# Altium project PowerPCB.PrjPcb
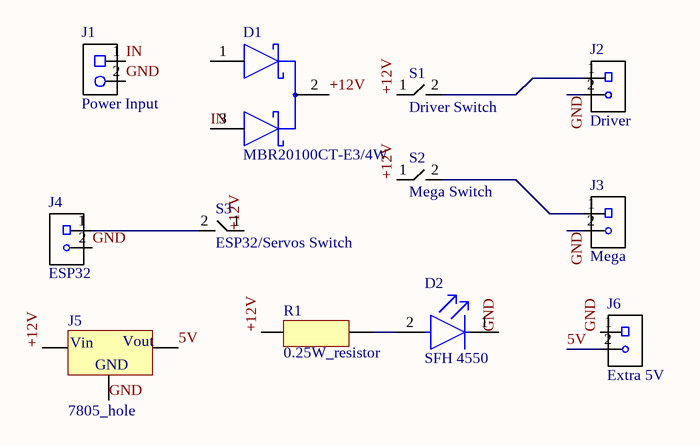
[diagram p0: PowerSCH.SchDoc]
1 sheet, 12 parts. Net scope: global (net labels, ports and power ports of the same name join across sheets).
Board file: PowerPCB.PcbDoc

## Sheet PowerSCH.SchDoc
size A; SheetNumber: 1; SheetTotal: 1

### Parts
D1  MBR20100CT-E3/4W  [FP-MBR20100CT-E3-4W-MFG]
D2  SFH 4550  [FP-SFH_4550-MFG]
J1  Power Input  [Barrier Terminal 2P]
J2  Driver  [Screw Terminal 2 pins]
J3  Mega  [Screw Terminal 2 pins]
J4  ESP32  [Screw Terminal 2 pins]
J5  7805_hole  [780X_hole]
J6  Extra 5V  [Screw Terminal 2 pins]
R1  0.25W_resistor  [0.25W_resistor]
S1  Driver Switch  [ON/OFF_Switch_17*11]
S2  Mega Switch  [ON/OFF_Switch_17*11]
S3  ESP32/Servos Switch  [ON/OFF_Switch_17*11]

### Nets
5V: J5.2 J6.2
+12V: D1.2(COMMON_CATHODE) J5.1 R1.2 S1.1 S2.1 S3.1
GND: D2.1(C) J1.2(-) J2.2 J3.2 J4.2 J5.3 J6.1
IN: D1.3(2_ANODE) J1.1(+)
NetD2_2: D2.2(A) R1.1
NetJ2_1: J2.1 S1.2
NetJ3_1: J3.1 S2.2
NetJ4_1: J4.1 S3.2

Not connected (* = marked no-connect by the designer): D1 1(1_ANODE)

### Notes on the sheet
- (in symbol 7805_hole) Vin; Vout; GND

### Library data of the parts
D1 = CMP-00030-42878425-1: MBR20100CT-E3/4W Dual Common-Cathode High-Voltage Schottky Rectifier; Forward Voltage: 800mV; Max Junction Temperature (Tj): 150°C; Forward Current: 20A; Max Reverse Voltage (DC): 100V; Max Surge Current: 150A; Max Reverse Leakage Current: 100µA; Average Rectified Current: 10A; Element Configuration: Common Cathode; Length: 10.5156mm; Schedule B: 8541100080, 8541100080; Case/Package: TO-220AB; NexarPartId: 42878425; Number of Pins: 3; Min Operating Temperature: -65°C; Reverse Voltage: 100V; Height: 15.3162mm; Peak Non-Repetitive Surge Current: 150A; RoHS: Compliant; Max Operating Temperature: 150°C; Radiation Hardening: No; Lead Free: Lead Free; Mount: Through Hole; Max Repetitive Reverse Voltage (Vrrm): 100V; Max Forward Surge Current (Ifsm): 150A; Width: 4.699mm; Peak Reverse Current: 100µA
D2 = CMP-62016-000011-1: EMITTER IR 860NM 100MA RADIAL; Manufacturer: Osram Opto; Forward Voltage: 1.5V; Reverse Voltage: 5V; Viewing Angle: 6°; Description: Infrared Emitter, 3 , T-1 3/4 (5mm), 100 mA, 1.5 V, 12 ns, 12 ns; Led Orientation: Straight; Colour: Infrared; Mouser Description: Infrared Emitters - High Power Infrared 850 nm HALF ANGLE +/-3DEG; RoHS: TRUE; Manufacturer Part Number: SFH 4550; Forward Current: 100mA; Octopart: https://octopart.com/sfh+4550-osram+opto-55410894; ComponentLink2Description: Datasheet; Lead Free: Yes; Temperature: -40°C to +100°C; ComponentLink2URL: https://dammedia.osram.info/media/resource/hires/osram-dam-5580407/SFH%204550_EN.pdf; Device Class L2: LEDs; Temperature Range Low: -40°C; Digikey Description: EMITTER IR 860NM 100MA RADIAL; Temperature Range High: +100°C; Device Class L3: unset; Peak Emmision Wavelength: 860nm; Category: Diode; Package: SFH 4550; Device Class L1: Optoelectronics; Automotive: No
J1 = Barrier Terminal 2P: Manufacturer: DORABO; Manufacturer Part #: DBT50G-9.5-2P-BK-P OGC; Seller Part #: 3496300101634; Seller: Makers Electronics
J2-J4 J6 = Screw Terminal 2 pins: Brass Alloy 1x2P 16A -40℃~+105℃ 300V Blue Tin 12~24 Direct Insert 5.08mm 1 2 Plugin,P=5.08mm Screw Terminal Blocks ROHS; Manufacturer: CUI; Manufacturer Part Number: TB004-508-02BE; Supplier: LSCS ELECTRONICS; Supplier Part Number: C3818636
S1-S3 = ON/OFF_Switch_17*11